# EAGLE design Midi4Ub (EAGLE 5.11)
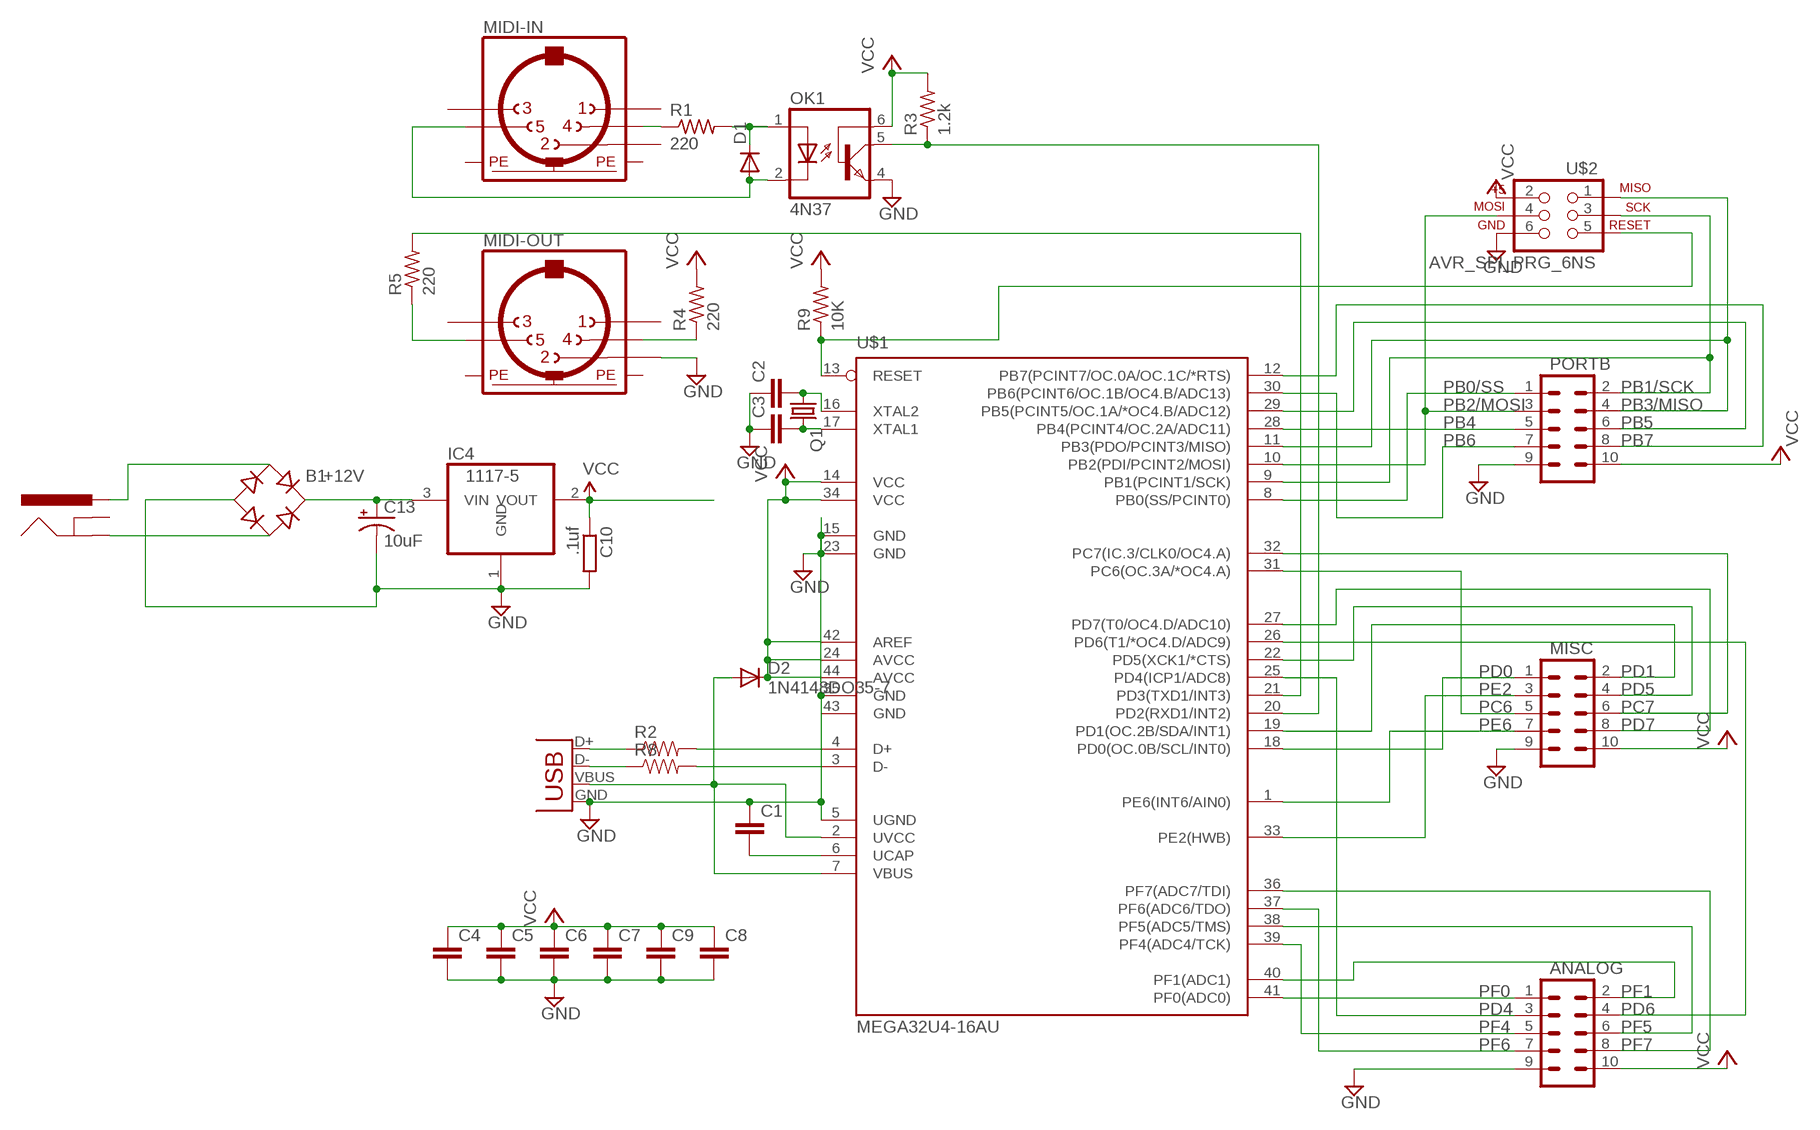
[diagram p0: schematic, sheet 1]

## Parts
ANALOG  M05X2PTH  [AVR_ICSP]
B1  B-DIL  [B-DIL]
C1  CAP0805  [0805]
C2  CAP0805  [0805]
C3  CAP0805  [0805]
C4  CAP0805  [0805]
C5  CAP0805  [0805]
C6  CAP0805  [0805]
C7  CAP0805  [0805]
C8  CAP0805  [0805]
C9  CAP0805  [0805]
C10  .1uf  R-EU_M0805  [M0805]
C13  10uF  CAP_POLC  [PANASONIC_C]
D1  DIODESOD  [SOD-323]
D2  1N4148DO35-7  [DO35-7]
IC4  1117-5  REG1117  [SOT223]
J1  POWER_JACKPTH  [POWER_JACK_PTH]
MIDI-IN  MAB5SH  [MAB5SH]
MIDI-OUT  MAB5SH  [MAB5SH]
MISC  M05X2PTH  [AVR_ICSP]
OK1  4N37  [DIL06]
PORTB  M05X2PTH  [AVR_ICSP]
Q1  CRYSTALHC49S  [HC49/S]
R1  220  R-US_R0805  [R0805]
R2  RESISTOR  [0805]
R3  1.2k  R-US_M0805  [M0805]
R4  220  R-US_R0805  [R0805]
R5  220  R-US_R0805  [R0805]
R8  RESISTOR  [0805]
R9  10K  R-US_R0805  [R0805]
U$1  MEGA32U4-16AU  [TQFP44]
U$2  AVR_SPI_PRG_6NS  [2X3-NS]
X1  USBPTH  [USB-B-PTH]

## Nets
*RESET: R9.1 U$1.13(RESET) U$2.5
+12V: B1.+ C13.+ IC4.3(VIN)
GND: ANALOG.9 B1.- C1.1 C2.1 C3.1 C4.2 C5.2 C6.2 C7.2 C8.2 C9.2 C10.2 C13.- IC4.1(GND) MIDI-OUT.2 MISC.9 OK1.4(EMI) PORTB.9 U$1.5(UGND) U$1.15(GND) U$1.23(GND) U$1.35(GND) U$1.43(GND) U$2.6 X1.GND
N$1: D2.A U$1.2(UVCC) U$1.7(VBUS) X1.VBUS
N$2: D1.1(C) OK1.1(A) R1.2
N$3: R2.2 U$1.4(D+)
N$4: MIDI-IN.4 R1.1
N$5: MIDI-OUT.5 R5.1
N$6: MIDI-OUT.4 R4.1
N$7: D1.2(A) MIDI-IN.5 OK1.2(C)
N$8: C1.2 U$1.6(UCAP)
N$9: R2.1 X1.D+
N$11: B1.AC2 J1.GND
N$12: B1.AC1 J1.PWR
N$14: R8.2 U$1.3(D-)
N$15: R8.1 X1.D-
N$17: C3.2 Q1.2 U$1.17(XTAL1)
N$18: C2.2 Q1.1 U$1.16(XTAL2)
PB0/SS: PORTB.1 U$1.8(PB0(SS/PCINT0))
PB1/SCK: PORTB.2 U$1.9(PB1(PCINT1/SCK)) U$2.3
PB2/MOSI: PORTB.3 U$1.10(PB2(PDI/PCINT2/MOSI)) U$2.4
PB3/MISO: PORTB.4 U$1.11(PB3(PDO/PCINT3/MISO)) U$2.1
PB4: PORTB.5 U$1.28(PB4(PCINT4/OC.2A/ADC11))
PB5: PORTB.6 U$1.29(PB5(PCINT5/OC.1A/*OC4.B/ADC12))
PB6: PORTB.7 U$1.30(PB6(PCINT6/OC.1B/OC4.B/ADC13))
PB7: PORTB.8 U$1.12(PB7(PCINT7/OC.0A/OC.1C/*RTS))
PC6: MISC.5 U$1.31(PC6(OC.3A/*OC4.A))
PC7: MISC.6 U$1.32(PC7(IC.3/CLK0/OC4.A))
PD0: MISC.1 U$1.18(PD0(OC.0B/SCL/INT0))
PD1: MISC.2 U$1.19(PD1(OC.2B/SDA/INT1))
PD4: ANALOG.3 U$1.25(PD4(ICP1/ADC8))
PD5: MISC.4 U$1.22(PD5(XCK1/*CTS))
PD6: ANALOG.4 U$1.26(PD6(T1/*OC4.D/ADC9))
PD7: MISC.8 U$1.27(PD7(T0/OC4.D/ADC10))
PE2: MISC.3 U$1.33(PE2(HWB))
PE6: MISC.7 U$1.1(PE6(INT6/AIN0))
PF0: ANALOG.1 U$1.41(PF0(ADC0))
PF1: ANALOG.2 U$1.40(PF1(ADC1))
PF4: ANALOG.5 U$1.39(PF4(ADC4/TCK))
PF5: ANALOG.6 U$1.38(PF5(ADC5/TMS))
PF6: ANALOG.7 U$1.37(PF6(ADC6/TDO))
PF7: ANALOG.8 U$1.36(PF7(ADC7/TDI))
RX: R5.2 U$1.21(PD3(TXD1/INT3))
TX: OK1.5(COL) R3.1 U$1.20(PD2(RXD1/INT2))
VCC: ANALOG.10 C4.1 C5.1 C6.1 C7.1 C8.1 C9.1 C10.1 D2.C IC4.2(VOUT) MISC.10 OK1.6(BAS) PORTB.10 R3.2 R4.2 R9.2 U$1.14(VCC) U$1.24(AVCC) U$1.34(VCC) U$1.42(AREF) U$1.44(AVCC) U$2.2
Unconnected: J1.GNDBREAK MIDI-IN.1 MIDI-IN.2 MIDI-IN.3 MIDI-OUT.1 MIDI-OUT.3

## Power pins joined to a net without a drawn wire
PE: MIDI-IN.PE MIDI-IN.PE@(PE) MIDI-OUT.PE MIDI-OUT.PE@(PE)

## Library data of the parts
ANALOG MISC PORTB = 3d:M05X2: Header 5x2 Standard 10-pin dual row 0.1" header. Commonly used with AVR-ISP. Use with Spark Fun Electronics SKU: PRT-00778
B1 = rectifier:B-DIL: RECTIFIER
C1-C9 = 3d:CAP: Capacitor Standard 0603 ceramic capacitor, and 0.1" leaded capacitor.
C10 = resistor:R-EU_: RESISTOR, European symbol
C13 = asynlabs:CAP_POL: Capacitor Polarized These are standard SMD and PTH capacitors. Normally 10uF, 47uF, and 100uF in electrolytic and tantalum varieties. Always verify the external diameter of the through hole cap, it varies with capacity, voltage, and manufacturer. The EIA devices should be standard.
D1 = 3d:DIODE: Diode These are standard reverse protection diodes and small signal diodes. SMA package can handle up to about 1A. SOD-323 can handle about 200mA. What the SOD-323 package when ordering, there are some mfgs out there that are 5-pin packages.
D2 = diode:1N4148: DIODE high speed (Philips)
IC4 = burr-brown:REG1117: 800mA and 1A Low Dropout (LDO) Positive Regulator 1.8V, 2.5V, 2.85V, 3.3V, 5V, and Adj; MPN: REG1117; OC_FARNELL: 1097566; OC_NEWARK: 14P6981
J1 = 3d2011:POWER_JACK: Power Jack This is the standard 5.5mm barrel jack for power. The PTH is the most common, proven, reliable, footprint. All others are experimental. The Slot footprint only works if the mill layer is transmitted to the PCB fab house so be warned. Spark Fun Electronics SKU : PRT-00119. Mating wall wart : TOL-00298 (and others)
MIDI-IN MIDI-OUT = con-hirschmann:MAB5SH: Female CONNECTOR 5 pins 90 deg. with shield, horizontal (DIN 41524)
OK1 = optocoupler:4N37: OPTO COUPLER Source: http://www.fairchildsemi.com/pf/4N/4N35-M.html
Q1 = crystal:CRYSTAL: CRYSTAL
R1 R3-R5 R9 = rcl:R-US_: RESISTOR, American symbol
R2 R8 = 3d:RESISTOR: Resistor Basic schematic elements and footprints for 0603, 1206, and PTH 1/10th watt (small) resistors.
U$1 = at90usb:MEGA32U4: ATmega16U4/ATmega32U4 Atmel USB Microprossessor
U$2 = 3d2011:AVR_SPI_PRG_6: AVR ISP 6 Pin This is the reduced ISP connector for AVR programming. Common on Arduino. This footprint will take up less PCB space and can be used with a 10-pin to 6-pin adapter such as SKU: BOB-08508
X1 = 3d:USB: USB Connectors USB-B-PTH is fully proven SKU : PRT-00139 USB-miniB is fully proven SKU : PRT-00587 USB-A-PCB is untested. USB-A-H is throughly reviewed, but untested. Spark Fun Electronics SKU : PRT-00437 USB-B-SMT is throughly reviewed, but untested. Needs silkscreen touching up. USB-A-S has not been used/tested USB-MB-H has not been used/tested

## Net classes
0 default: width 0.203 mm
1 vcc: width 0.254 mm

## Board
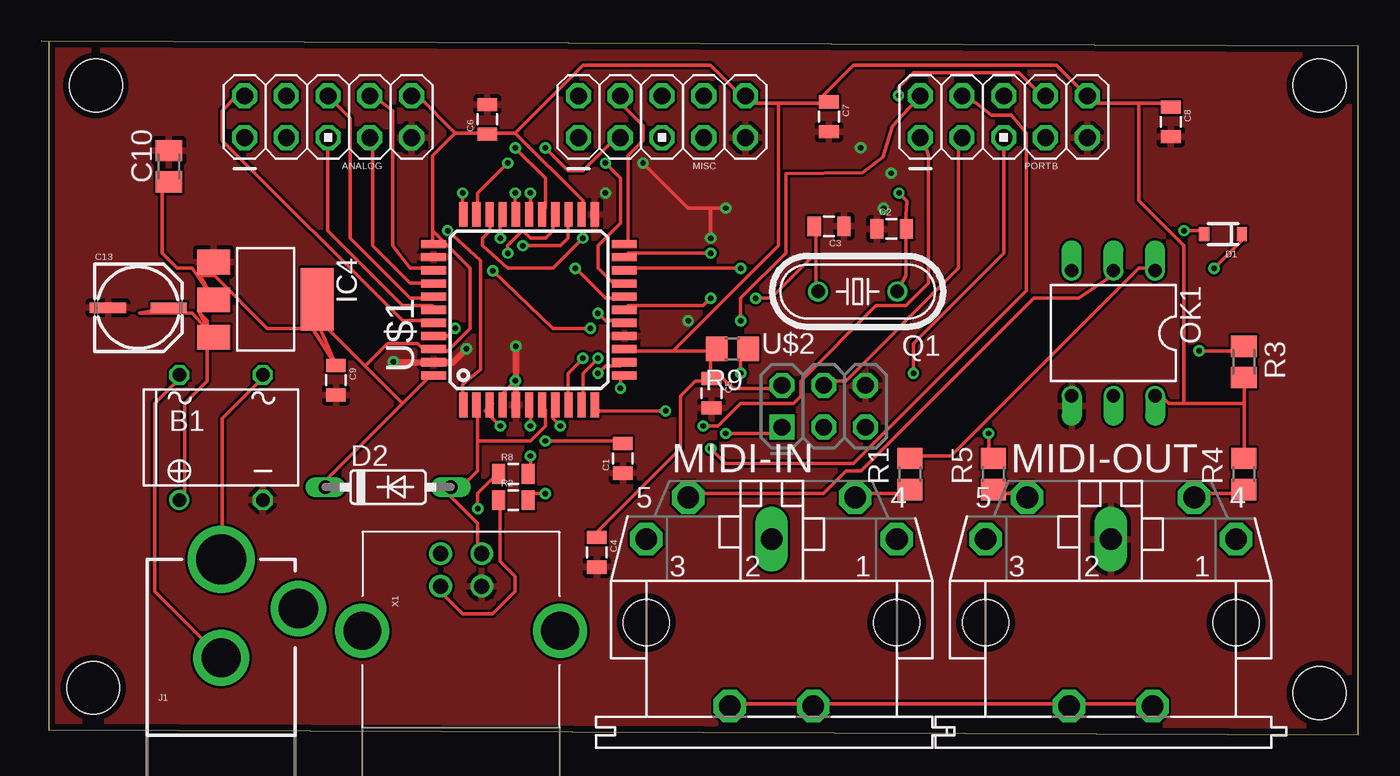
[diagram p1: board, top side]
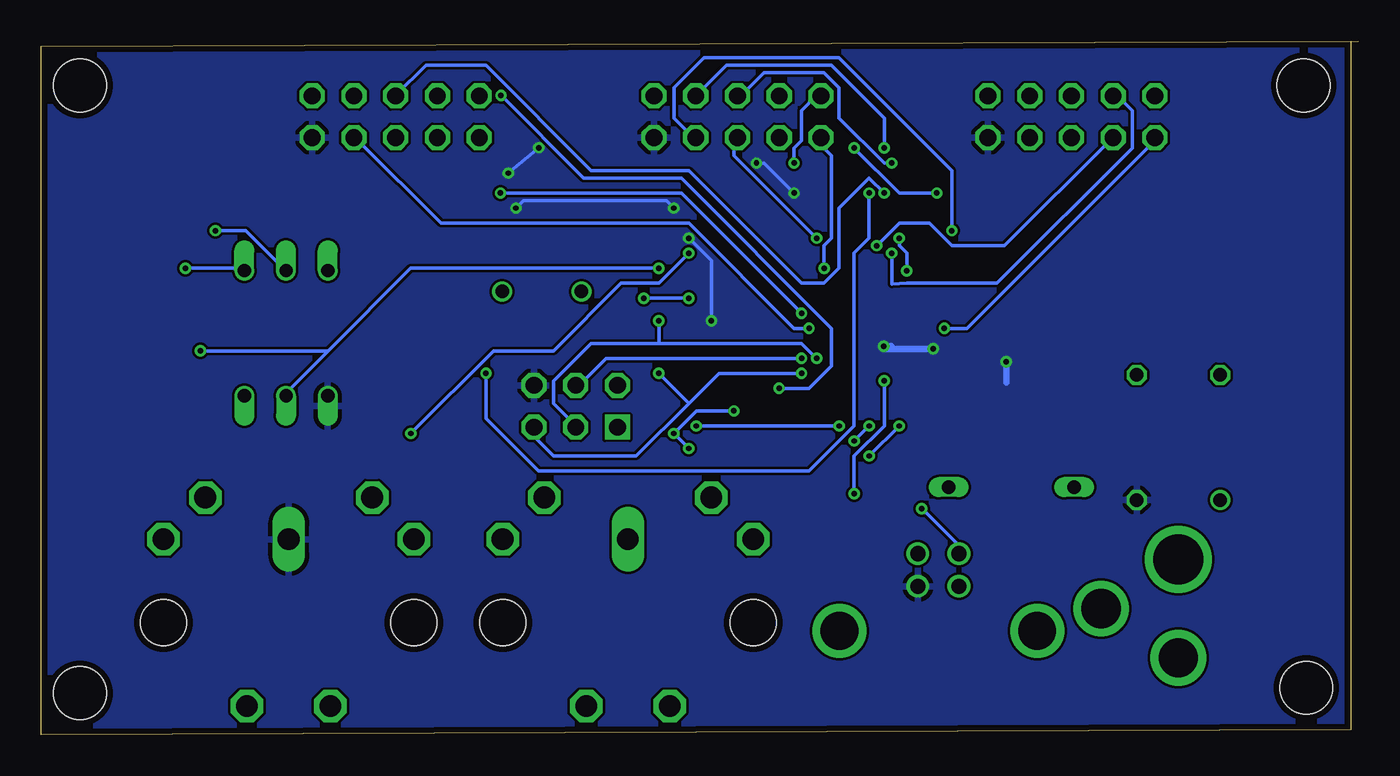
[diagram p2: board, bottom side, seen from below]

Size 80.16 x 42.23 mm. Coordinates in mm from the lower left corner, seen from the top.
Outline: 0.48,42.23 0.48,0.32 80.16,0 80.16,41.9 0,42.22
Copper layers (1*16): Top 0.0356mm / dielectric 1.5011mm / Bottom 0.0356mm
Design rules "LaenPCBOrder": minimum track width 6mil, minimum drill 13mil, track to track 6mil, track to pad 6mil, pad to pad 6mil, via to via 6mil, smd to smd 6mil, copper to edge 15mil, drill to drill 6mil, minimum pad ring 7mil, minimum via ring 7mil, stop-mask expansion 4mil, vias tented up to drill 0mil, thermal gap 10mil
Holes 3.2 mm at 3.33,39.53 3.18,2.86 77.79,2.54 77.79,39.53

### Footprints (pad centres in the part's own frame; a part is rotated, then mirrored left to right if it is on the bottom)
AVR_ICSP = drill 1.016 octagon: 1 -1.27,5.08; 2 1.27,5.08; 3 -1.27,2.54; 4 1.27,2.54; 5 -1.27,0; 6 1.27,0; 7 -1.27,-2.54; 8 1.27,-2.54; 9 -1.27,-5.08; 10 1.27,-5.08
B-DIL = drill 0.813 round: + -2.54,-3.81 | drill 0.813 octagon: - 2.54,-3.81; AC1 2.54,3.81; AC2 -2.54,3.81
0805 = smd 0.8 x 1.2: 1 -0.9,0; 2 0.9,0
M0805 = smd 1.3 x 1.6: 1 -0.95,0; 2 0.95,0
PANASONIC_C = smd 2.2 x 0.65: + 1.9,-0.2; - -1.8,-0.2
SOD-323 = smd 0.63 x 0.83: 1 -1.15,0; 2 1.15,0
DO35-7 = drill 0.813 long: A 3.81,0; C -3.81,0
SOT223 = smd 1.499 x 2.007: 1 -2.261,-3.15; 2 0.025,-3.15; 3 2.311,-3.15 | smd 3.81 x 2.007: 4 0,3.15
POWER_JACK_PTH = drill 2.381 round: GND 0,7.7; GNDBREAK 4.7,10.7 | drill 3.048 round: PWR 0,13.7
MAB5SH = drill 1.321 octagon: 1 7.62,5.08; 3 -7.62,5.08; 4 5.08,7.62; 5 -5.08,7.62; PE -2.54,-5.08; PE@ 2.54,-5.08 | drill 1.321 long: 2 0,5.08 | hole 2.794: 7.62,0; -7.62,0
DIL06 = drill 0.813 offset: 1 -2.54,-3.81; 2 0,-3.81; 3 2.54,-3.81; 4 2.54,3.81; 5 0,3.81; 6 -2.54,3.81
HC49/S = drill 0.813 round: 1 -2.413,0; 2 2.413,0
R0805 = smd 1.3 x 1.5: 1 -0.95,0; 2 0.95,0
TQFP44 = smd 1.5 x 0.5: 1 -5.8,4; 2 -5.8,3.2; 3 -5.8,2.4; 4 -5.8,1.6; 5 -5.8,0.8; 6 -5.8,0; 7 -5.8,-0.8; 8 -5.8,-1.6; 9 -5.8,-2.4; 10 -5.8,-3.2; 11 -5.8,-4; 23 5.8,-4; 24 5.8,-3.2; 25 5.8,-2.4; 26 5.8,-1.6; 27 5.8,-0.8; 28 5.8,0; 29 5.8,0.8; 30 5.8,1.6; 31 5.8,2.4; 32 5.8,3.2; 33 5.8,4 | smd 0.5 x 1.5: 12 -4,-5.8; 13 -3.2,-5.8; 14 -2.4,-5.8; 15 -1.6,-5.8; 16 -0.8,-5.8; 17 0,-5.8; 18 0.8,-5.8; 19 1.6,-5.8; 20 2.4,-5.8; 21 3.2,-5.8; 22 4,-5.8; 34 4,5.8; 35 3.2,5.8; 36 2.4,5.8; 37 1.6,5.8; 38 0.8,5.8; 39 0,5.8; 40 -0.8,5.8; 41 -1.6,5.8; 42 -2.4,5.8; 43 -3.2,5.8; 44 -4,5.8
2X3-NS = drill 1.016 square: 1 -2.54,-1.27 | drill 1.016 octagon: 2 -2.54,1.27; 3 0,-1.27; 4 0,1.27; 5 2.54,-1.27; 6 2.54,1.27
USB-B-PTH = drill 0.914 round: D+ 0,1.25; D- 1.981,1.25; GND 0,-1.25; VBUS 1.981,-1.25 | drill 2.286 round: P$1 -2.718,-6.02; P$2 -2.718,6.02

### Placement (x,y rotation side)
ANALOG  17.46,37.62 90 top
B1  10.95,18.1 0 top
C1  35.4,16.83 90 top
C2  51.75,30.8 0 top
C3  47.94,30.96 180 top
C4  33.81,11.11 270 top
C5  40.8,20.8 270 top
C6  27.15,37.46 90 top
C7  47.94,37.62 270 top
C8  68.74,37.31 270 top
C9  17.94,21.59 270 top
C10  7.78,34.61 90 top
C13  5.87,26.19 0 top
D1  71.91,30.48 180 top
D2  21.11,15.08 0 top
IC4  13.65,26.51 270 top
J1  10.95,-3.02 0 top
MIDI-IN  44.45,6.83 0 top
MIDI-OUT  65.09,6.83 0 top
MISC  37.78,37.62 90 top
OK1  65.25,24.45 180 top
PORTB  58.58,37.62 90 top
Q1  49.69,26.99 180 top
R1  52.86,15.87 90 top
R2  28.73,14.29 0 top
R3  73.18,22.7 270 top
R4  73.18,15.87 90 top
R5  57.94,15.87 90 top
R8  28.73,15.87 0 top
R9  42.07,23.49 180 top
U$1  29.69,25.88 90 top
U$2  47.62,20 0 top
X1  25.56,9.05 90 top

### Tracks (layer width: path | path; a pad name or v marks a point on that pad's centre or on a via)
*RESET  (via drill 0.33)
  Top 0.203: v33.88,22 34.34,22.46 35.25,22.46 U$1.13 | v42.57,22 42.57,23.37 R9.1
  Bottom 0.203: v33.88,22 38.91,22 40.74,20.17 | 40.74,20.17 43.94,16.97 48.97,16.97 50.34,18.34 U$2.5 | 40.74,20.17 v42.57,22
+12V
  Top 0.203: C13.+ 5.99,25.66 9.2,25.66 IC4.3 9.65,25.66 10.11,25.2 10.11,21.55 8.74,20.17 8.74,14.69 B1.+
GND  (via drill 0.33)
  Top 0.203: 40.74,32.06 39.37,32.06 v36.63,34.8 | 40.74,32.06 v41.66,32.06 | v40.74,30.23 40.74,32.06
  Top 0.406: v21.43,22.7 21.43,22.68 U$1.43 25.06,22.68 v25.88,23.49 | U$1.5 v28.89,23.65
  Bottom 0.203: v51.73,34.19 v49.87,35.74 | v51.26,32.06 50.8,32.52 42.11,32.52 v41.66,32.06 | v36.63,34.8 36.17,34.8 v34.34,32.98 | v40.74,30.23 39.37,28.86 v39.37,25.2
  Bottom 0.406: 21.43,21.43 v21.43,22.7 | v28.89,23.65 28.42,23.65 | v25.88,23.49 28.73,23.49 v28.89,23.65 | v28.89,23.65 29.05,23.65
  pour Bottom: -0.95,42.07 81.6,41.75 81.6,-0.16 -0.95,0.16
  pour Top: -1.59,42.39 81.12,42.07 81.12,0.16 -0.95,0.16
N$1
  Top 0.203: 26.57,17.89 26.57,16.06 25.2,14.69 D2.A 24.74,14.69 26.57,12.86 26.57,11.03 X1.VBUS | 26.57,17.89 26.57,19.72 U$1.2 | 26.57,17.89 29.77,17.89 30.68,18.8 30.68,19.72 U$1.7
N$2  (via drill 0.33)
  Top 0.203: v71.37,28.4 73.2,30.23 D1.1 | R1.2 53.09,16.97 55.37,16.97 66.8,28.4 67.72,28.4 OK1.1
  Bottom 0.203: v71.37,28.4 68.17,28.4 OK1.1
N$3  (via drill 0.33)
  Top 0.203: v30.68,14.69 29.77,14.69 R2.2 | v28.85,21.55 27.94,20.63 27.94,20.17 U$1.4
  Bottom 0.203: v30.68,14.69 30.68,16.97 28.85,18.8 v28.85,21.55
N$4
  Top 0.203: R1.1 52.63,14.69 49.89,14.69 MIDI-IN.4
N$5
  Top 0.203: R5.1 58.12,14.69 59.94,14.69 MIDI-OUT.5
N$6
  Top 0.203: R4.1 72.75,14.69 70.46,14.69 MIDI-OUT.4
N$7  (via drill 0.33)
  Top 0.203: v69.55,30.69 70.46,30.69 D1.2 | MIDI-IN.5 39.37,14.69 47.6,14.69 48.97,16.06 49.89,16.06 60.4,26.57 63.14,26.57 65.13,27.93 OK1.2
  Bottom 0.203: v69.55,30.69 67.72,30.69 65.43,28.4 OK1.2
N$8  (via drill 0.33)
  Top 0.203: v30.68,17.89 35.25,17.89 C1.2 | v29.77,18.8 29.77,19.72 U$1.6
  Bottom 0.203: v29.77,18.8 v30.68,17.89
N$9
  Top 0.203: R2.1 27.94,14.23 27.94,10.57 28.85,9.66 28.85,8.74 27.48,7.37 25.65,7.37 24.28,8.74 X1.D+
N$11
  Top 0.203: B1.AC2 8.28,21.55 6.91,20.17 6.91,8.74 10.57,5.09 J1.GND
N$12
  Top 0.203: B1.AC1 13.31,21.55 11.02,19.26 11.02,11.03 J1.PWR
N$14  (via drill 0.33)
  Top 0.203: v29.77,16.97 29.77,16.06 R8.2 | v27.94,18.8 27.03,19.72 27.48,20.17 U$1.3
  Bottom 0.203: v29.77,16.97 v27.94,18.8
N$15  (via drill 0.33)
  Top 0.203: v26.57,13.77 26.57,14.69 27.48,15.6 R8.1
  Bottom 0.203: v26.57,13.77 24.28,11.49 24.28,11.03 X1.D-
N$17  (via drill 0.33)
  Top 0.203: 47.14,29.32 47.14,27.03 Q1.2 | 47.14,29.32 47.14,30.69 C3.2 | v40.74,26.57 40.28,26.12 35.71,26.12 U$1.17 | v43.48,26.57 44.4,26.57 47.14,29.32
  Bottom 0.203: v40.74,26.57 v43.48,26.57
N$18  (via drill 0.33)
  Top 0.203: Q1.1 52.19,27.19 52.63,27.95 52.63,30.69 C2.2 52.63,31.15 52.63,31.6 52.69,32.5 v52.2,32.98 | v33.88,25.66 34.34,25.2 35.25,25.2 U$1.16
  Bottom 0.203: v33.88,25.66 41.2,32.98 v52.2,32.98
PB0/SS  (via drill 0.33)
  Top 0.203: v31.6,18.8 31.14,19.26 31.14,19.72 U$1.8 | v40.28,18.8 41.2,18.8 42.57,20.17 45.77,20.17 46.23,20.63 46.23,21.55 50.8,26.12 52.63,26.12 54,27.49 54,35.26 53.72,36.18 PORTB.1
  Bottom 0.203: v31.6,18.8 v40.28,18.8
PB1/SCK  (via drill 0.33)
  Top 0.203: v32.97,22.92 32.05,22 32.05,20.17 U$1.9 | v42.57,25.2 42.57,26.57 45.31,29.32 45.31,34.14 49.98,34.21 51.21,35.16 51.82,37.03 PORTB.2
  Bottom 0.203: v32.97,22.92 33.88,23.83 42.57,23.83 | 42.57,23.83 46.68,23.83 48.97,21.55 48.97,20.17 47.6,18.8 U$2.3 | 42.57,23.83 v42.57,25.2
PB2/MOSI  (via drill 0.33)
  Top 0.203: v33.88,22.92 32.97,22 32.97,20.17 U$1.10 | PORTB.3 55.83,36.18 55.83,28.4 48.97,21.55 48.06,21.55 U$2.4
  Bottom 0.203: v33.88,22.92 45.77,22.92 47.6,21.09 U$2.4
PB3/MISO  (via drill 0.33)
  Top 0.203: v38,19.72 33.88,19.72 U$1.11 | v41.66,18.34 44.86,18.34 U$2.1 | v40.74,17.43 41.66,16.52 49.43,16.52 59.94,27.03 59.94,36.63 59.03,37.71 57.84,37.71 56.92,38.46 PORTB.4
  Bottom 0.203: v38,19.72 40.28,19.72 v41.66,18.34 v40.74,17.43
PB4  (via drill 0.33)
  Top 0.203: v29.77,32.98 29.77,32.06 U$1.28 | v53.09,22 53.09,23.83 58.57,29.32 58.57,36.18 PORTB.5
  Bottom 0.203: v29.77,32.98 29.77,30.23 30.68,29.32 30.68,18.8 33.43,16.06 49.89,16.06 53.09,19.26 v53.09,22
PB5  (via drill 0.33)
  Top 0.203: v28.85,32.98 28.85,32.06 U$1.29
  Bottom 0.203: v28.85,32.98 29.77,33.89 31.6,32.06 31.6,28.4 32.51,27.49 33.88,27.49 40.74,34.35 46.68,34.35 53.09,40.75 56.74,40.75 58.57,38.92 PORTB.6
PB6  (via drill 0.33)
  Top 0.203: v27.94,30.23 27.94,31.6 U$1.30 | v27.48,28.24 31.14,24.75 v33.43,24.75
  Bottom 0.203: v27.94,30.23 27.94,29.77 27.48,29.32 v27.48,28.24 | v33.43,24.75 34.34,24.75 40.74,31.15 55.83,31.15 60.86,36.18 PORTB.7
PB7  (via drill 0.33)
  Top 0.203: v35.25,21.09 35.25,22 U$1.12 | v52.17,38.92 52.17,39.38 53.09,40.29 59.49,40.29 60.86,38.92 PORTB.8
  Bottom 0.203: v35.25,21.09 33.43,21.09 32.05,22.46 32.05,24.75 41.2,33.89 47.14,33.89 v52.17,38.92
PC6  (via drill 0.33)
  Top 0.203: v32.97,30.23 31.14,28.4 28.4,28.4 26.87,29.77 26.87,30.23 27.32,30.69 27.32,31.6 U$1.31
  Bottom 0.203: v32.97,30.23 38,35.26 38,36.18 MISC.5
PC7  (via drill 0.33)
  Top 0.203: v28.4,34.8 26.57,32.98 26.57,32.06 U$1.32
  Bottom 0.203: v28.4,34.8 28.85,34.8 31.6,37.55 31.6,39.38 32.51,40.29 36.17,40.29 37.54,38.92 MISC.6
PD0  (via drill 0.33)
  Top 0.203: v32.51,28.4 34.34,26.57 35.25,26.57 U$1.18
  Bottom 0.203: v32.51,28.4 32.51,29.77 32.05,30.23 32.05,35.26 32.97,36.18 MISC.1
PD1  (via drill 0.33)
  Top 0.203: v34.34,34.8 35.25,33.89 35.25,31.15 33.88,29.77 33.88,28.4 34.8,27.49 35.25,27.49 U$1.19
  Bottom 0.203: v34.34,34.8 34.34,35.72 33.88,36.18 33.88,38 32.97,38.92 MISC.2
PD4  (via drill 0.33)
  Top 0.203: v29.31,29.77 31.6,29.77 32.05,30.23 32.05,31.6 U$1.25
  Bottom 0.203: v29.31,29.77 27.94,31.15 26.11,31.15 24.74,29.77 21.54,29.77 15.14,36.18 ANALOG.3
PD5
  Top 0.203: U$1.22 35.71,29.77 35.71,35.26 36.63,36.18 36.63,37.09 35.25,38.46 MISC.4
PD6  (via drill 0.33)
  Top 0.203: v28.4,29.32 28.4,29.77 29.31,30.69 29.77,30.23 30.68,30.23 31.14,30.69 31.14,31.6 U$1.26
  Bottom 0.203: v28.4,29.32 28.4,27.45 27.48,27.49 22,27.49 13.77,35.72 13.77,38 14.68,38.92 ANALOG.4
PD7  (via drill 0.33)
  Top 0.203: v28.85,35.72 30.68,33.89 30.68,32.06 U$1.27
  Bottom 0.203: v28.85,35.72 28.85,37.55 32.05,40.75 38.46,40.75 40.28,38.92 MISC.8
PE
  Top 0.203: MIDI-IN.PE 42.11,1.89 46.68,1.89 MIDI-IN.PE@ 47.14,1.89 62.23,1.89 MIDI-OUT.PE 62.69,1.89 67.26,1.89 MIDI-OUT.PE@
PE2  (via drill 0.33)
  Top 0.203: v25.65,32.98 25.65,32.06 U$1.33 | v30.68,35.72 32.05,34.35 32.97,34.35 34.8,36.18 MISC.3
  Bottom 0.203: v25.65,32.98 27.94,32.98 v30.68,35.72
PE6  (via drill 0.33)
  Top 0.203: v24.74,30.69 26.73,28.86 26.73,22.22 25.65,21.31 25.65,20.17 U$1.1
  Bottom 0.203: v24.74,30.69 24.74,34.35 31.6,41.2 39.83,41.2 41.66,39.38 41.66,37.55 40.74,36.63 MISC.7
PF0  (via drill 0.33)
  Top 0.203: v25.2,24.75 24.74,24.29 24.28,24.29 U$1.41
  Bottom 0.203: v25.2,24.75 23.83,24.75 12.4,36.18 ANALOG.1
PF1
  Top 0.203: U$1.40 23.83,25.2 22,25.2 11.02,36.18 11.02,38 11.94,38.92 ANALOG.2
PF4
  Top 0.203: U$1.39 23.83,26.12 22,26.12 17.42,30.69 17.42,36.18 ANALOG.5
PF5
  Top 0.203: U$1.38 23.83,26.57 22.45,26.57 18.8,30.23 18.8,37.55 17.88,38.46 ANALOG.6
PF6
  Top 0.203: U$1.37 23.83,27.49 22.45,27.49 20.17,29.77 20.17,36.18 ANALOG.7
PF7
  Top 0.203: U$1.36 23.83,28.4 22.45,28.4 21.4,29.77 21.4,38 20.17,38.92 ANALOG.8
RX  (via drill 0.33)
  Top 0.203: v40.74,29.32 35.71,29.32 U$1.21 | v57.66,18.34 57.66,16.97 R5.2
  Bottom 0.203: v40.74,29.32 42.57,27.49 44.86,27.49 48.97,23.37 52.63,23.37 v57.66,18.34
TX  (via drill 0.33)
  Top 0.203: v42.57,28.4 35.71,28.4 U$1.20 | v70.46,23.37 72.75,23.37 R3.1
  Bottom 0.203: v42.57,28.4 57.66,28.4 62.69,23.37 | 62.69,23.37 64.97,21.09 OK1.5 | 62.69,23.37 v70.46,23.37
VCC
  Top 0.203: C10.1 7.37,33.43 7.37,29.32 8.28,28.4 9.2,28.4 IC4.2 9.65,27.95 10.57,27.95 13.77,24.75 16.51,24.75 C9.1 16.97,24.75 17.42,24.75 19.71,22.46 | 25.2,36.63 27.03,36.63 C6.1 27.48,36.63 28.85,36.63 | 25.2,36.63 22.91,38.92 ANALOG.10 | 23.83,30.69 23.83,35.26 25.2,36.63 | 23.83,30.69 23.83,29.77 U$1.34 | 28.85,36.63 32.97,32.52 32.97,32.06 U$1.24 | 73.2,20.17 73.2,21.55 R3.2 | 73.2,20.17 73.2,16.97 R4.2 | 69.55,20.17 73.2,20.17 | 69.55,20.17 68.63,20.17 68.17,20.63 OK1.6 | 66.8,38.46 64.06,38.46 PORTB.10 63.6,38.92 61.77,40.75 49.43,40.75 47.6,38.92 C7.1 47.6,38.46 44.86,38.46 | 66.8,38.46 68.63,38.46 C8.1 | 44.86,38.46 43.03,38.46 MISC.10 42.57,38.92 40.74,40.75 32.97,40.75 28.85,36.63 | 38.46,23.37 40.74,23.37 | 38.46,23.37 35.71,23.37 U$1.14 | C4.1 33.88,12.4 38.91,17.43 38.91,20.63 39.83,21.55 40.74,21.55 C5.1 | U$2.2 44.86,21.09 42.11,21.09 41.2,22 C5.1 | 40.74,23.37 40.74,22 C5.1 | 40.74,23.37 R9.2 | 44.86,38.46 44.86,29.77 38.46,23.37 | 69.55,20.17 69.55,29.77 66.8,32.52 66.8,38.46 | 23.83,30.69 26.11,28.4 26.11,24.75 24.74,23.37 24.28,23.37 U$1.42 23.83,23.37 23.37,23.37 22.91,23.83 21.08,23.83 19.71,22.46 | 22,20.17 16.97,15.14 D2.C | 22,20.17 23.83,22 U$1.44 | 22,20.17 19.71,22.46